# EAGLE design link (EAGLE 7.6.0)
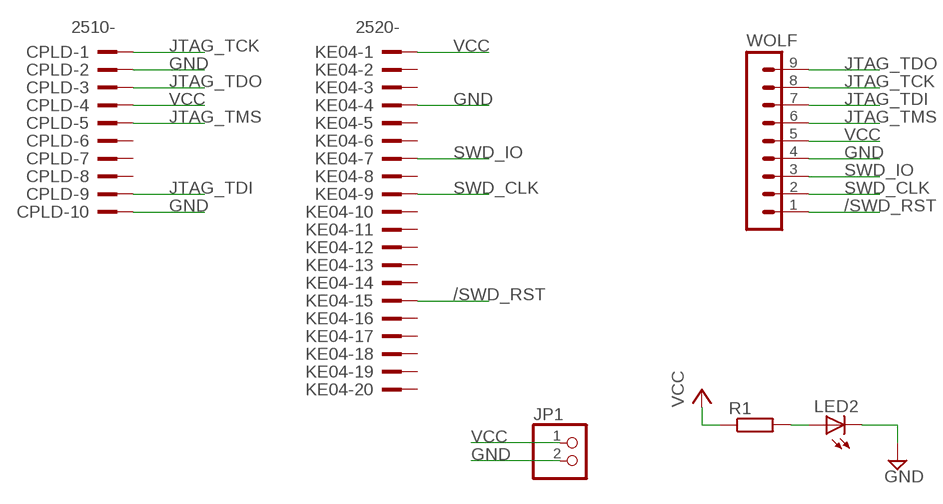
[diagram p0: schematic, sheet 1]

## Parts
CPLD  2510-  [PAK100/2500-10]
JP1  PINHD-1X2  [1X02]
KE04  2520-  [PAK100/2500-20]
LED2  LEDSML0805  [SML0805]
R1  R-EU_R0805  [R0805]
WOLF  MA09-1  [MA09-1]

## Nets
/SWD_RST: KE04.15 WOLF.1
GND: CPLD.2 CPLD.10 JP1.2 KE04.4 LED2.C WOLF.4
JTAG_TCK: CPLD.1 WOLF.8
JTAG_TDI: CPLD.9 WOLF.7
JTAG_TDO: CPLD.3 WOLF.9
JTAG_TMS: CPLD.5 WOLF.6
N$1: LED2.A R1.2
SWD_CLK: KE04.9 WOLF.2
SWD_IO: KE04.7 WOLF.3
VCC: CPLD.4 JP1.1 KE04.1 R1.1 WOLF.5
Unconnected: CPLD.6 CPLD.7 CPLD.8 KE04.2 KE04.3 KE04.5 KE04.6 KE04.8 KE04.10 KE04.11 KE04.12 KE04.13 KE04.14 KE04.16 KE04.17 KE04.18 KE04.19 KE04.20

## Library data of the parts
CPLD = con-3m:2510-: 3M (TM) Pak 100 4-Wall Header Source: 3M; MF: 3M; MPN: 2510-6002UB; OC_FARNELL: 9838244; OC_NEWARK: 46F4725
JP1 = pinhead:PINHD-1X2: PIN HEADER
KE04 = con-3m:2520-: 3M (TM) Pak 100 4-Wall Header Source: 3M; OC_FARNELL: unknown; OC_NEWARK: unknown
LED2 = led:LED: LED OSRAM: - CHIPLED LG R971, LG N971, LY N971, LG Q971, LY Q971, LO R971, LY R971 LH N974, LH R974 LS Q976, LO Q976, LY Q976 LO Q996 - Hyper CHIPLED LW Q18S LB Q993, LB Q99A, LB R99A - SideLED LS A670, LO A670, LY A670, LG A670, LP A670 LB A673, LV A673, LT A673, LW A673 LH A674 LY A675 LS A676, LA A676, LO A676, LY A676, LW A676 LS A679, LY A679, LG A679 - Hyper Micro SIDELED® LS Y876, LA Y876, LO Y876, LY Y876 LT Y87S - SmartLED LW L88C, LW L88S LB L89C, LB L89S, LG L890 LS L89K, LO L89K, LY L89K LS L896, LA L896, LO L896, LY L896 - TOPLED LS T670, LO T670, LY T670, LG T670, LP T670 LSG T670, LSP T670, LSY T670, LOP T670, LYG T670 LG T671, LOG T671, LSG T671 LB T673, LV T673, LT T673, LW T673 LH T674 LS T676, LA T676, LO T676, LY T676, LB T676, LH T676, LSB T676, LW T676 LB T67C, LV T67C, LT T67C, LS T67K, LO T67K, LY T67K, LW E67C LS E67B, LA E67B, LO E67B, LY E67B, LB E67C, LV E67C, LT E67C LW T67C LS T679, LY T679, LG T679 LS T770, LO T770, LY T770, LG T770, LP T770 LB T773, LV T773, LT T773, LW T773 LH T774 LS E675, LA E675, LY E675, LS T675 LS T776, LA T776, LO T776, LY T776, LB T776 LHGB T686 LT T68C, LB T68C - Hyper Mini TOPLED® LB M676 - Mini TOPLED Santana® LG M470 LS M47K, LO M47K, LY M47K Source: http://www.osram.convergy.de LUXEON: - LUMILED® LXK2-PW12-R00, LXK2-PW12-S00, LXK2-PW14-U00, LXK2-PW14-V00 LXK2-PM12-R00, LXK2-PM12-S00, LXK2-PM14-U00 LXK2-PE12-Q00, LXK2-PE12-R00, LXK2-PE12-S00, LXK2-PE14-T00, LXK2-PE14-U00 LXK2-PB12-K00, LXK2-PB12-L00, LXK2-PB12-M00, LXK2-PB14-N00, LXK2-PB14-P00, LXK2-PB14-Q00 LXK2-PR12-L00, LXK2-PR12-M00, LXK2-PR14-Q00, LXK2-PR14-R00 LXK2-PD12-Q00, LXK2-PD12-R00, LXK2-PD12-S00 LXK2-PH12-R00, LXK2-PH12-S00 LXK2-PL12-P00, LXK2-PL12-Q00, LXK2-PL12-R00 Source: www.luxeon.com KINGBRIGHT: KA-3528ASYC Source: www.kingbright.com
R1 = wolf_rev_c:R-EU_: RESISTOR, European symbol
WOLF = con-lstb:MA09-1: PIN HEADER; OC_FARNELL: unknown; OC_NEWARK: unknown

## Board
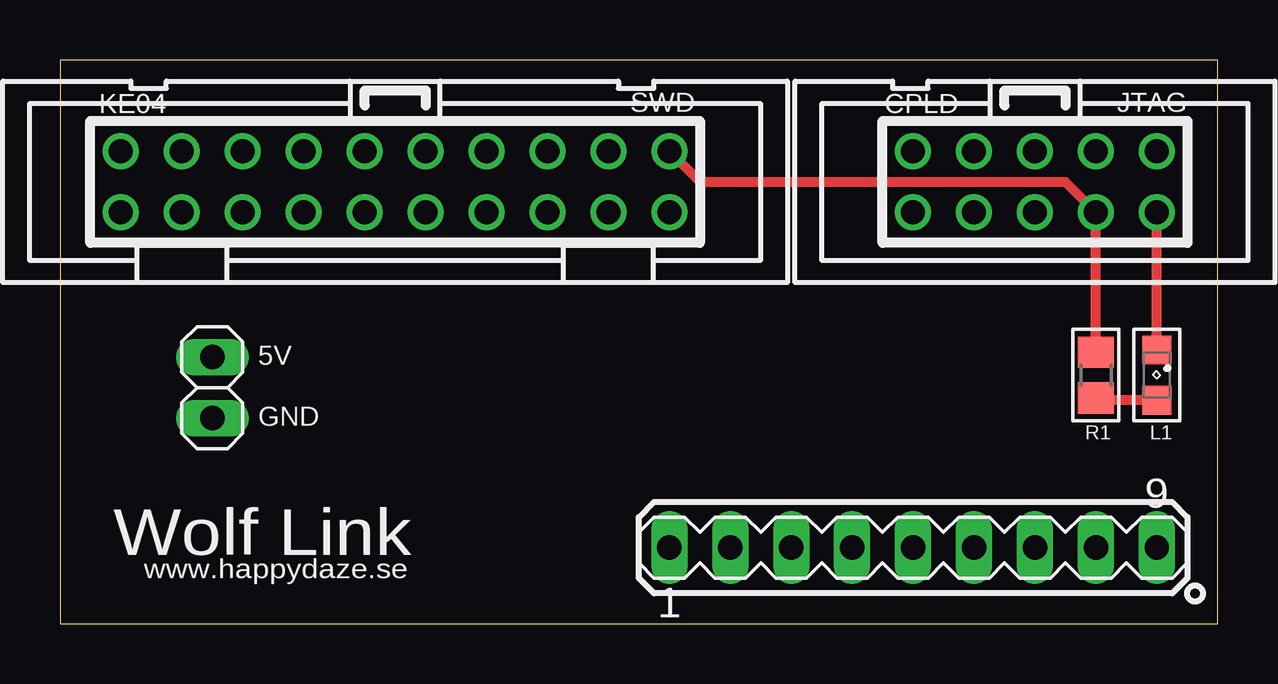
[diagram p1: board, top side]
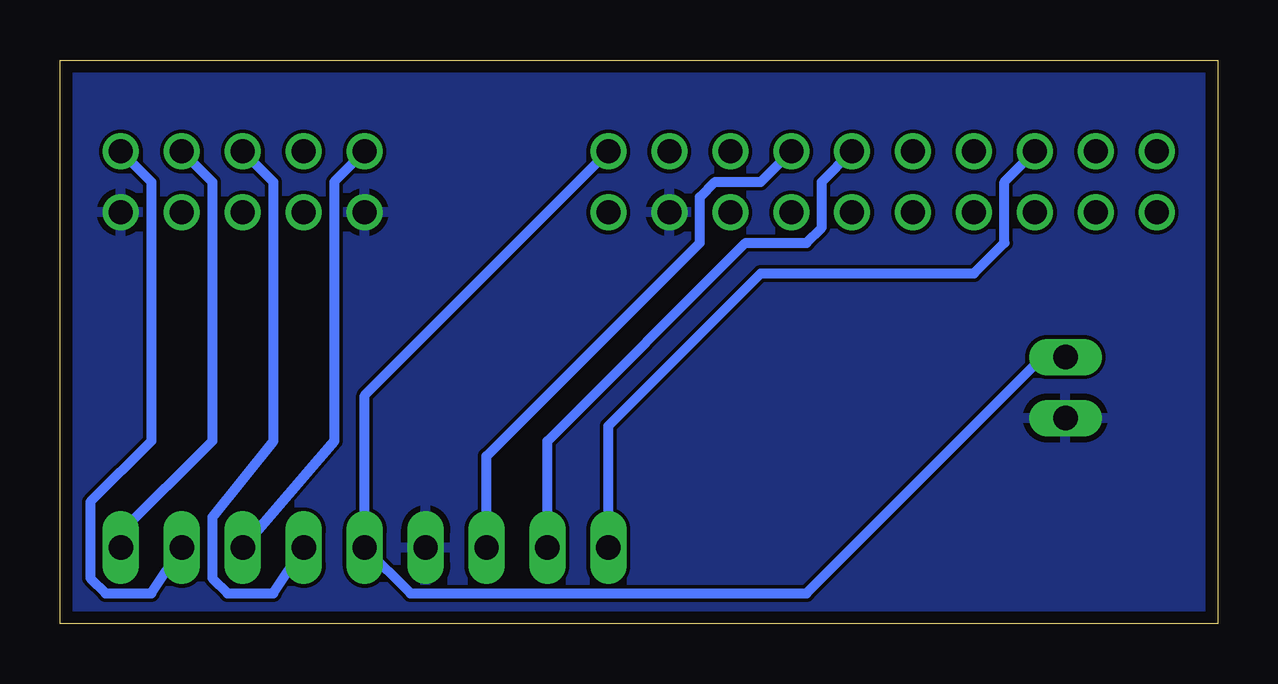
[diagram p2: board, bottom side, seen from below]

Size 48.26 x 23.5 mm. Coordinates in mm from the lower left corner, seen from the top.
Outline: 0,0 48.26,0 48.26,23.5 0,23.5 0,0
Copper layers (1*16): Top 0.035mm / dielectric 1.6mm / Bottom 0.035mm
Design rules "Elecrow_2-layer_PCB_eagle_rule": minimum track width 6mil, minimum drill 12mil, track to track 6mil, track to pad 6mil, pad to pad 6mil, via to via 8mil, smd to smd 0mil, copper to edge 20mil, drill to drill 10mil, minimum pad ring 6mil, minimum via ring 6mil, stop-mask expansion 0mil, vias tented up to drill 100mil, thermal gap 10mil

### Footprints (pad centres in the part's own frame; a part is rotated, then mirrored left to right if it is on the bottom)
PAK100/2500-10 = drill 1 pad 1.422: 1 -5.08,-1.27; 2 -5.08,1.27; 3 -2.54,-1.27; 4 -2.54,1.27; 5 0,-1.27; 6 0,1.27; 7 2.54,-1.27; 8 2.54,1.27; 9 5.08,-1.27; 10 5.08,1.27
1X02 = drill 1.016 long: 1 -1.27,0; 2 1.27,0
PAK100/2500-20 = drill 1 pad 1.422: 1 -11.43,-1.27; 2 -11.43,1.27; 3 -8.89,-1.27; 4 -8.89,1.27; 5 -6.35,-1.27; 6 -6.35,1.27; 7 -3.81,-1.27; 8 -3.81,1.27; 9 -1.27,-1.27; 10 -1.27,1.27; 11 1.27,-1.27; 12 1.27,1.27; 13 3.81,-1.27; 14 3.81,1.27; 15 6.35,-1.27; 16 6.35,1.27; 17 8.89,-1.27; 18 8.89,1.27; 19 11.43,-1.27; 20 11.43,1.27
SML0805 = smd 1.2 x 1.2: A 1.05,0; C -1.05,0
R0805 = smd 1.3 x 1.5: 1 -0.95,0; 2 0.95,0
MA09-1 = drill 1.016 long: 1 -10.16,0; 2 -7.62,0; 3 -5.08,0; 4 -2.54,0; 5 0,0; 6 2.54,0; 7 5.08,0; 8 7.62,0; 9 10.16,0

### Placement (x,y rotation side)
CPLD  40.64,18.41 180 top
JP1  6.35,9.84 270 top
KE04  13.97,18.41 180 top
LED2  45.72,10.36 270 top
R1  43.18,10.36 270 top
WOLF  35.56,3.17 0 top

### Tracks (layer width: path | path; a pad name or v marks a point on that pad's centre or on a via)
/SWD_RST
  Bottom 0.406: WOLF.1 25.4,8.26 19.05,14.61 10.16,14.61 8.89,15.88 8.89,18.41 KE04.15
GND
  Top 0.406: LED2.C CPLD.2
  pour Bottom: 0.64,0.64 0.64,22.86 47.62,22.86 47.62,0.64
JTAG_TCK
  Bottom 0.406: CPLD.1 44.45,18.41 44.45,7.62 46.99,5.08 46.99,1.91 46.35,1.27 44.45,1.27 WOLF.8
JTAG_TDI
  Bottom 0.406: CPLD.9 36.83,18.41 36.83,7.62 WOLF.7
JTAG_TDO
  Bottom 0.406: CPLD.3 41.91,18.41 41.91,7.62 45.72,3.81 WOLF.9
JTAG_TMS
  Bottom 0.406: CPLD.5 39.37,18.41 39.37,7.62 41.91,4.45 41.91,1.91 41.27,1.27 39.37,1.27 WOLF.6
N$1
  Top 0.406: LED2.A 43.28,9.31 R1.2
SWD_CLK
  Bottom 0.406: WOLF.2 27.94,7.62 19.68,15.88 17.14,15.88 16.51,16.51 16.51,18.41 KE04.9
SWD_IO
  Bottom 0.406: WOLF.3 30.48,6.99 21.59,15.88 21.59,17.78 20.95,18.41 19.05,18.41 KE04.7
VCC
  Top 0.406: R1.1 CPLD.4 41.91,18.41 26.67,18.41 KE04.1
  Bottom 0.406: KE04.1 35.56,9.53 WOLF.5 33.66,1.27 17.14,1.27 7.62,10.79 6.67,10.79 JP1.1

### Text on the board
tNames: SWD | JTAG | 5V | GND | R1 | L1 | Wolf Link | www.happydaze.se